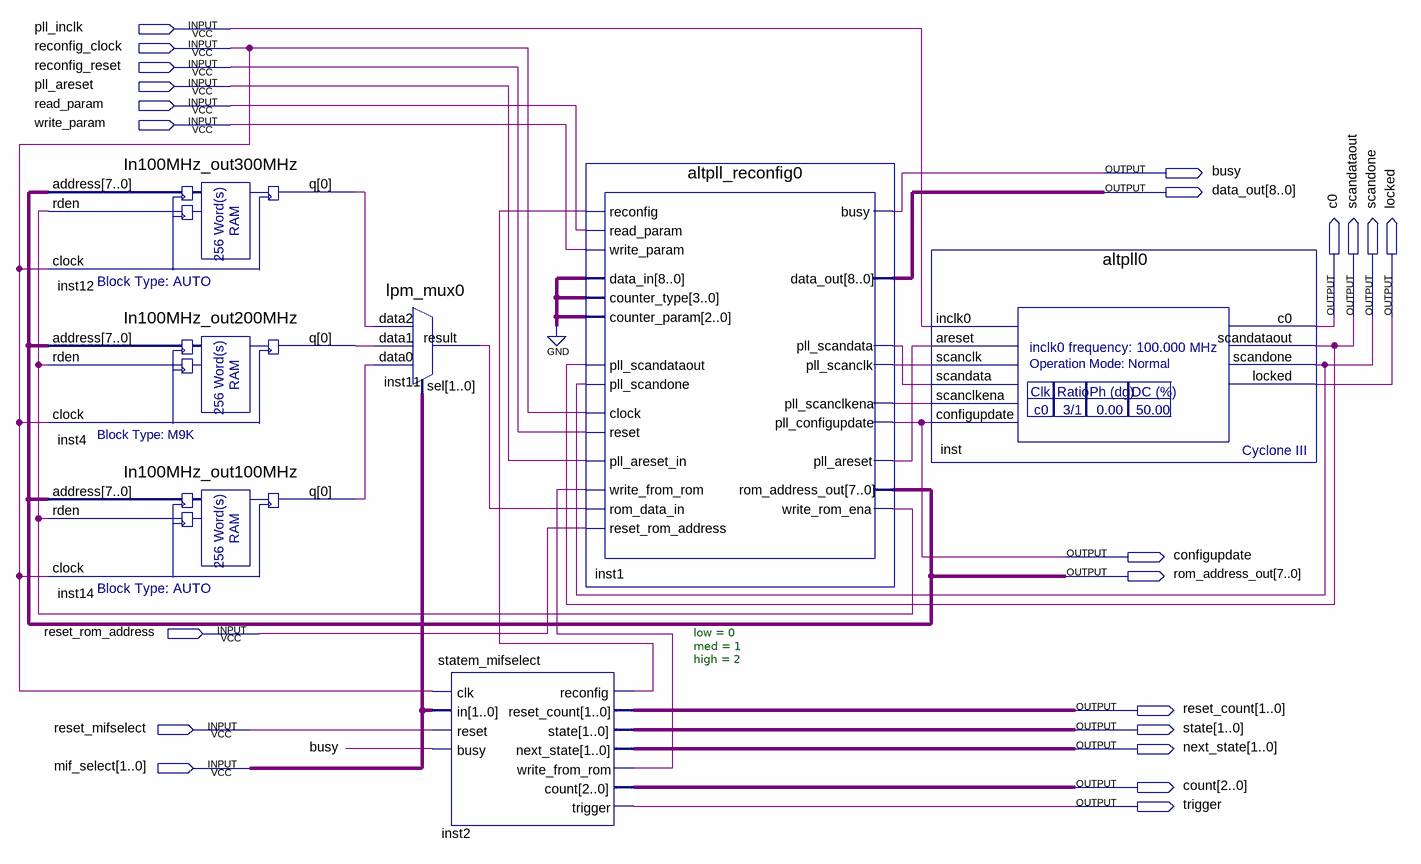
[diagram p0: schematic sheet]
// Quartus schematic reconfig_mif.bdf as structural Verilog: 7 symbols, 22 pins
module reconfig_mif (
  input  pll_inclk,
  input  reconfig_clock,
  input  reconfig_reset,
  input  pll_areset,
  input  read_param,
  input  write_param,
  input  reset_rom_address,
  input  reset_mifselect,
  input  [1:0] mif_select,
  output busy,
  output [8:0] data_out,
  output c0,
  output scandataout,
  output scandone,
  output locked,
  output configupdate,
  output [7:0] rom_address_out,
  output [1:0] reset_count,
  output [1:0] state,
  output [1:0] next_state,
  output [2:0] count,
  output trigger
);

  wire inst1_pll_areset, inst1_pll_scanclk, inst1_pll_scanclkena, inst1_pll_scandata, inst1_write_rom_ena,
       inst2_reconfig, inst2_write_from_rom, inst4_q, inst11_result, inst12_q, inst14_q;

  In100MHz_out300MHz inst12 (
    .address(rom_address_out), .rden(inst1_write_rom_ena), .clock(reconfig_clock), .q(inst12_q));
  In100MHz_out200MHz inst4 (.address(rom_address_out), .rden(inst1_write_rom_ena), .clock(reconfig_clock), .q(inst4_q));
  In100MHz_out100MHz inst14 (
    .address(rom_address_out), .rden(inst1_write_rom_ena), .clock(reconfig_clock), .q(inst14_q));
  lpm_mux0 inst11 (.data2(inst12_q), .data1(inst4_q), .data0(inst14_q), .sel(mif_select), .result(inst11_result));
  statem_mifselect #(.low(0), .med(1), .high(2)) inst2 (
    .clk(reconfig_clock), .in(mif_select), .reset(reset_mifselect), .busy(busy), .reconfig(inst2_reconfig),
    .reset_count(reset_count), .state(state), .next_state(next_state), .write_from_rom(inst2_write_from_rom),
    .count(count), .trigger(trigger));
  altpll_reconfig0 inst1 (
    .reconfig(inst2_reconfig), .read_param(read_param), .write_param(write_param), .data_in({9{1'b0}}),
    .counter_type({9{1'b0}}), .counter_param({9{1'b0}}), .pll_scandataout(scandataout),
    .pll_scandone(scandone), .clock(reconfig_clock), .reset(reconfig_reset), .pll_areset_in(pll_areset),
    .write_from_rom(inst2_write_from_rom), .rom_data_in(inst11_result),
    .reset_rom_address(reset_rom_address), .busy(busy), .data_out(data_out),
    .pll_scandata(inst1_pll_scandata), .pll_scanclk(inst1_pll_scanclk),
    .pll_scanclkena(inst1_pll_scanclkena), .pll_configupdate(configupdate), .pll_areset(inst1_pll_areset),
    .rom_address_out(rom_address_out), .write_rom_ena(inst1_write_rom_ena));
  altpll0 inst (
    .inclk0(pll_inclk), .areset(inst1_pll_areset), .scanclk(inst1_pll_scanclk),
    .scandata(inst1_pll_scandata), .scanclkena(inst1_pll_scanclkena), .configupdate(configupdate), .c0(c0),
    .scandataout(scandataout), .scandone(scandone), .locked(locked));
endmodule
